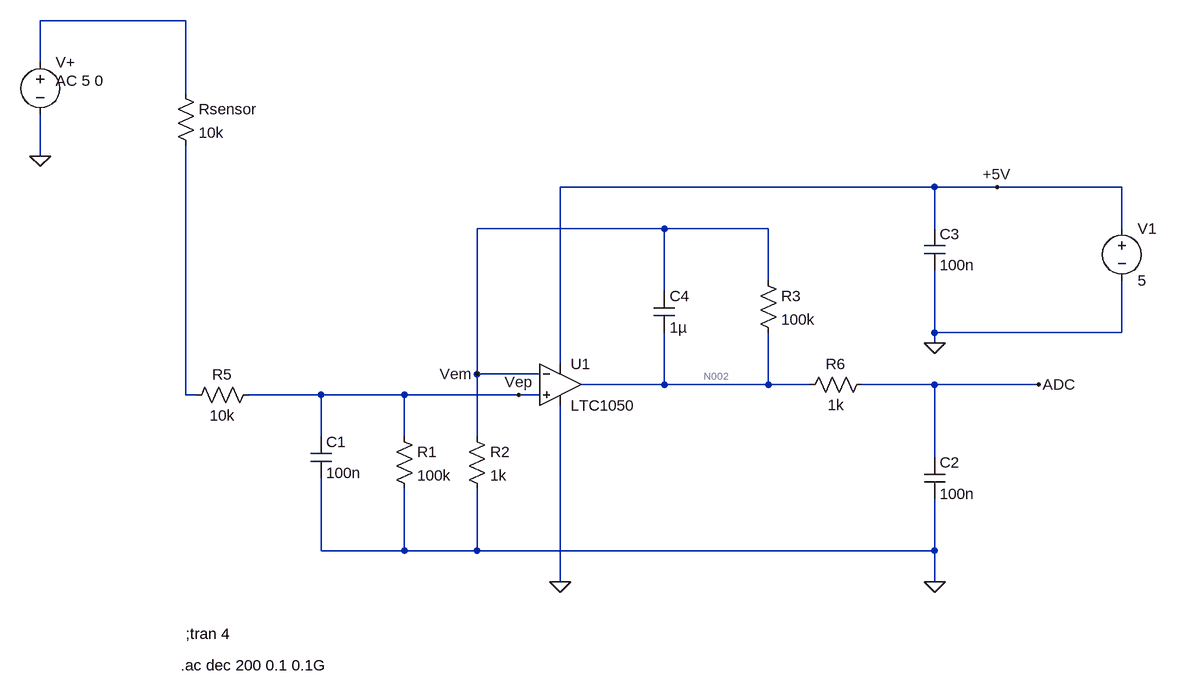
[diagram p0: schematic LTC1050 filtre+amp montage_graphite_sensor.asc]
LTC1050 filtre+amp montage_graphite_sensor.asc, the LTspice schematic file:
Version 4.1
SHEET 1 1432 680
WIRE -64 -512 -288 -512
WIRE -288 -448 -288 -512
WIRE -64 -400 -64 -512
WIRE -288 -304 -288 -368
WIRE 1088 -256 512 -256
WIRE 1184 -256 1088 -256
WIRE 1376 -256 1184 -256
WIRE 672 -192 384 -192
WIRE 832 -192 672 -192
WIRE 1088 -192 1088 -256
WIRE 1376 -192 1376 -256
WIRE 832 -112 832 -192
WIRE 672 -96 672 -192
WIRE 1088 -32 1088 -128
WIRE 1376 -32 1376 -112
WIRE 1376 -32 1088 -32
WIRE 1088 -16 1088 -32
WIRE 512 16 512 -256
WIRE 384 32 384 -192
WIRE 480 32 384 32
WIRE 672 48 672 -32
WIRE 672 48 544 48
WIRE 832 48 832 -32
WIRE 832 48 672 48
WIRE 896 48 832 48
WIRE 1088 48 976 48
WIRE 1248 48 1088 48
WIRE -64 64 -64 -320
WIRE -48 64 -64 64
WIRE 144 64 32 64
WIRE 272 64 144 64
WIRE 448 64 272 64
WIRE 480 64 448 64
WIRE 144 128 144 64
WIRE 272 128 272 64
WIRE 384 128 384 32
WIRE 1088 160 1088 48
WIRE 144 304 144 192
WIRE 272 304 272 208
WIRE 272 304 144 304
WIRE 384 304 384 208
WIRE 384 304 272 304
WIRE 1088 304 1088 224
WIRE 1088 304 384 304
WIRE 512 352 512 80
WIRE 1088 352 1088 304
FLAG 512 352 0
FLAG 1088 352 0
FLAG 1088 -16 0
FLAG 1248 48 ADC
FLAG 384 32 Vem
FLAG 448 64 Vep
FLAG 1184 -256 +5V
FLAG -288 -304 0
SYMBOL cap 128 128 R0
SYMATTR InstName C1
SYMATTR Value 100n
SYMBOL res 48 48 R90
WINDOW 0 0 56 VBottom 2
WINDOW 3 32 56 VTop 2
SYMATTR InstName R5
SYMATTR Value 10k
SYMBOL res 368 112 R0
SYMATTR InstName R2
SYMATTR Value 1k
SYMBOL res 256 112 R0
SYMATTR InstName R1
SYMATTR Value 100k
SYMBOL OpAmps\\LTC1050 512 -16 R0
SYMATTR InstName U1
SYMBOL cap 656 -96 R0
SYMATTR InstName C4
SYMATTR Value 1µ
SYMBOL res 816 -128 R0
SYMATTR InstName R3
SYMATTR Value 100k
SYMBOL res 992 32 R90
WINDOW 0 0 56 VBottom 2
WINDOW 3 32 56 VTop 2
SYMATTR InstName R6
SYMATTR Value 1k
SYMBOL cap 1072 160 R0
SYMATTR InstName C2
SYMATTR Value 100n
SYMBOL cap 1072 -192 R0
SYMATTR InstName C3
SYMATTR Value 100n
SYMBOL voltage 1376 -208 R0
WINDOW 123 0 0 Left 0
WINDOW 39 0 0 Left 0
SYMATTR InstName V1
SYMATTR Value 5
SYMBOL voltage -288 -464 R0
WINDOW 123 24 44 Left 2
WINDOW 39 0 0 Left 0
SYMATTR InstName V+
SYMATTR Value ""
SYMATTR Value2 AC 5 0
SYMBOL res -80 -416 R0
SYMATTR InstName Rsensor
SYMATTR Value 10k
TEXT -64 432 Left 2 !;tran 4
TEXT -72 480 Left 2 !.ac dec 200 0.1 0.1G

The netlist it stands for:
* LTC1050 filtre+amp montage_graphite_sensor.asc
C1 Vep 0 100n
R5 Vep N003 10k
R2 Vem 0 1k
R1 Vep 0 100k
X§U1 Vep Vem +5V 0 N002 LTC1050  ; pins In+ In- V+ V- OUT
C4 Vem N002 1µ
R3 Vem N002 100k
R6 ADC N002 1k
C2 ADC 0 100n
C3 +5V 0 100n
V1 +5V 0 5
V+ N001 0 AC 5 0
Rsensor N001 N003 10k
;tran 4
.ac dec 200 0.1 0.1G
.lib LTC.lib
.backanno
.end

* Results of the author's LTspice run, read from the files saved beside the schematic
* Operating Point, zero values left out:
*   V(+5v) = 5 V
*   V(n002) = 173.2 mV
*   V(vem) = 1.715 mV
*   V(adc) = 173.2 mV
*   I(R2) = 1.715 µA
*   I(V1) = -752.5 µA
*   I(R3) = -1.715 µA
*   Ix(u1:3) = 752.5 µA
*   Ix(u1:4) = -750.7 µA
*   Ix(u1:5) = -1.715 µA
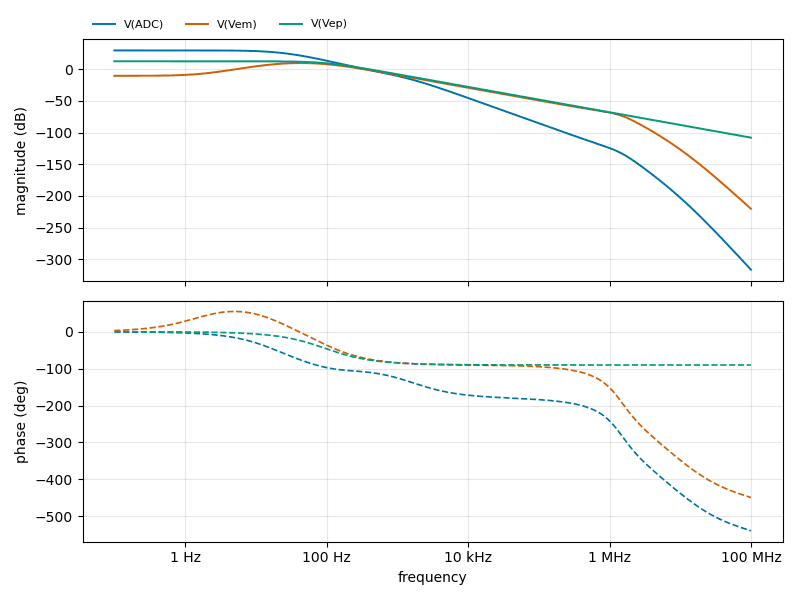
[diagram p1: AC Analysis of LTC1050 filtre+amp montage_graphite_sensor.asc, plotted from the saved traces]
* AC Analysis, 1 run:
*   V(ADC): 29.51 dB at 100 mHz, -316.20 dB at 100 MHz, peak 29.51 dB at 100 mHz, 3 dB below the peak at 18.96 Hz
*   V(Vem): -10.56 dB at 100 mHz, -220.24 dB at 100 MHz, peak 9.56 dB at 43.15 Hz, 3 dB below the peak at 14.23 Hz and 129.1 Hz
*   V(Vep): 12.40 dB at 100 mHz, -108.00 dB at 100 MHz, peak 12.40 dB at 100 mHz, 3 dB below the peak at 95.49 Hz